# EAGLE design Battery board V2 (EAGLE 7.6.0)
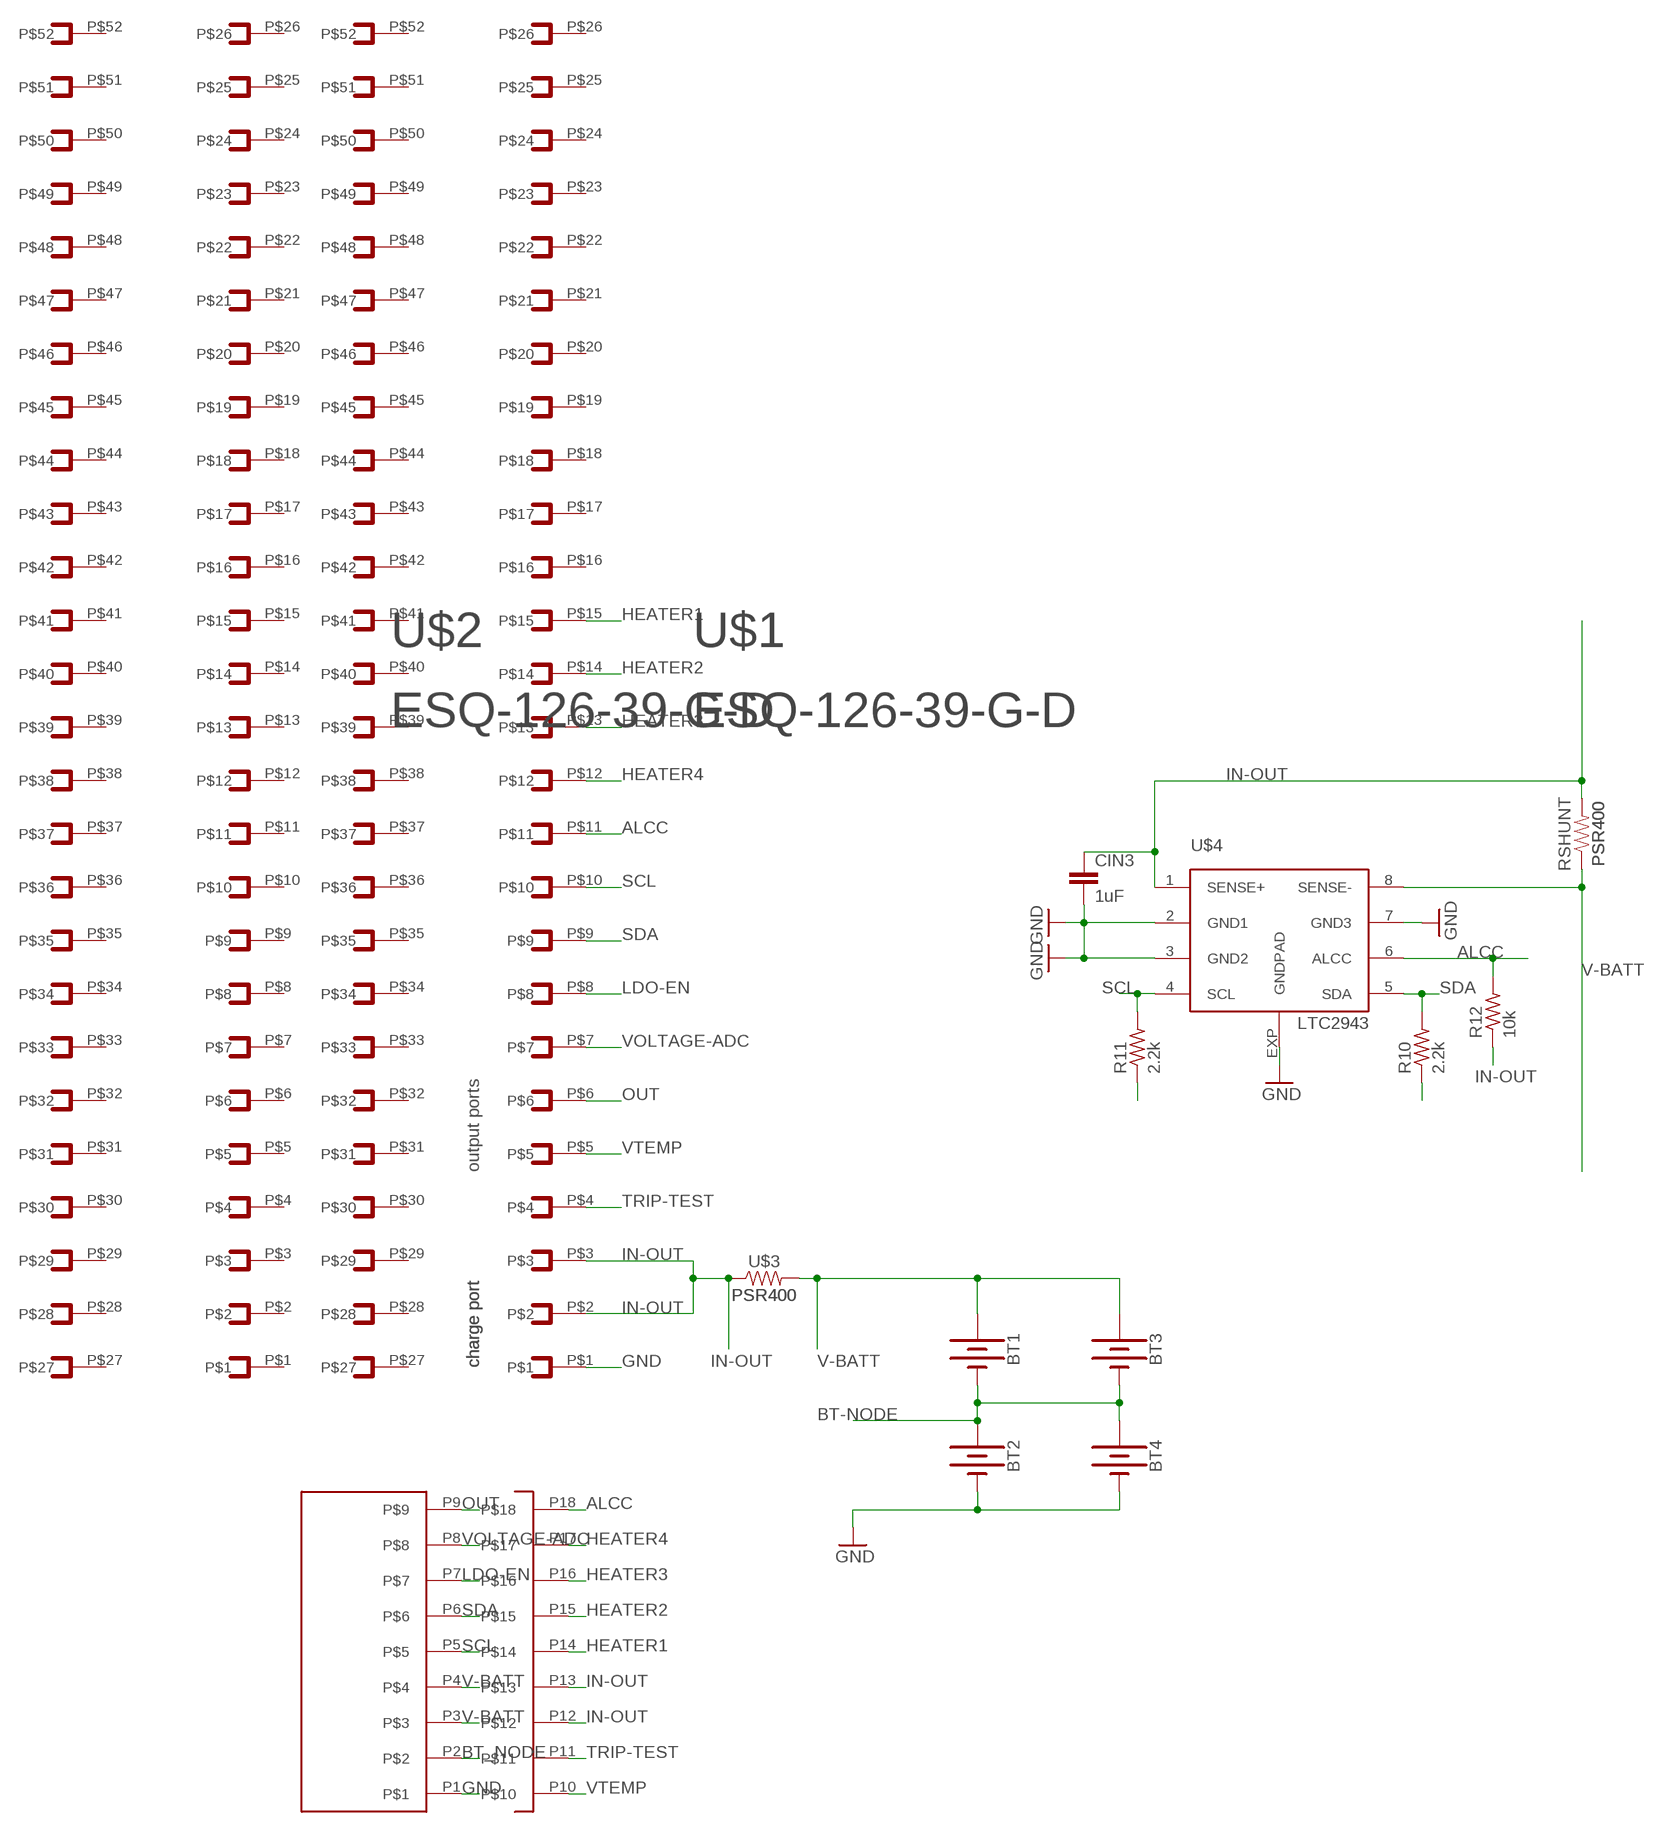
[diagram p0: schematic, sheet 1]

## Parts
BT1  BATTERY-18650  [BATTERY_18650-HOLDER]
BT2  BATTERY-18650  [BATTERY_18650-HOLDER]
BT3  BATTERY-18650  [BATTERY_18650-HOLDER]
BT4  BATTERY-18650  [BATTERY_18650-HOLDER]
CIN3  1uF  .1UF-CER  [0402-CAP]
R10  2.2k  R-US_R0805  [R0805]
R11  2.2k  R-US_R0805  [R0805]
R12  10k  R-US_R0805  [R0805]
RSHUNT  PSR400  [PSR400]
U$1  ESQ-126-39-G-D  [(RD)ESQ-126-39-G-D]
U$2  ESQ-126-39-G-D  [(RD)ESQ-126-39-G-D]
U$3  PSR400  [PSR400]
U$4  LTC2943  [DFN8(3X3)LT]
U$7  FFC18  [FFC18]

## Nets
ALCC: R12.2 U$1.P$11 U$4.6(ALCC) U$7.P18
BT-NODE: BT1.GND@1(-) BT2.PWR@1(+) BT3.GND@1(-) BT4.PWR@1(+)
BT_NODE: U$7.P2
GND: BT2.GND@1(-) BT4.GND@1(-) CIN3.2 U$1.P$1 U$4.2(GND1) U$4.3(GND2) U$4.7(GND3) U$4.EXP(GNDPAD) U$7.P1
HEATER1: U$1.P$15 U$7.P14
HEATER2: U$1.P$14 U$7.P15
HEATER3: U$1.P$13 U$7.P16
HEATER4: U$1.P$12 U$7.P17
IN-OUT: CIN3.1 R10.1 R11.1 R12.1 RSHUNT.P$2 U$1.P$2 U$1.P$3 U$3.P$1 U$4.1(SENSE+) U$7.P12 U$7.P13
LDO-EN: U$1.P$8 U$7.P7
OUT: U$1.P$6 U$7.P9
SCL: R11.2 U$1.P$10 U$4.4(SCL) U$7.P5
SDA: R10.2 U$1.P$9 U$4.5(SDA) U$7.P6
TRIP-TEST: U$1.P$4 U$7.P11
V-BATT: BT1.PWR@1(+) BT3.PWR@1(+) RSHUNT.P$1 U$3.P$2 U$4.8(SENSE-) U$7.P3 U$7.P4
VOLTAGE-ADC: U$1.P$7 U$7.P8
VTEMP: U$1.P$5 U$7.P10
Unconnected: U$1.P$16 U$1.P$17 U$1.P$18 U$1.P$19 U$1.P$20 U$1.P$21 U$1.P$22 U$1.P$23 U$1.P$24 U$1.P$25 U$1.P$26 U$1.P$27 U$1.P$28 U$1.P$29 U$1.P$30 U$1.P$31 U$1.P$32 U$1.P$33 U$1.P$34 U$1.P$35 U$1.P$36 U$1.P$37 U$1.P$38 U$1.P$39 U$1.P$40 U$1.P$41 U$1.P$42 U$1.P$43 U$1.P$44 U$1.P$45 U$1.P$46 U$1.P$47 U$1.P$48 U$1.P$49 U$1.P$50 U$1.P$51 U$1.P$52 U$2.P$1 U$2.P$2 U$2.P$3 U$2.P$4 U$2.P$5 U$2.P$6 U$2.P$7 U$2.P$8 U$2.P$9 U$2.P$10 U$2.P$11 U$2.P$12 U$2.P$13 U$2.P$14 U$2.P$15 U$2.P$16 U$2.P$17 U$2.P$18 U$2.P$19 U$2.P$20 U$2.P$21 U$2.P$22 U$2.P$23 U$2.P$24 U$2.P$25 U$2.P$26 U$2.P$27 U$2.P$28 U$2.P$29 U$2.P$30 U$2.P$31 U$2.P$32 U$2.P$33 U$2.P$34 U$2.P$35 U$2.P$36 U$2.P$37 U$2.P$38 U$2.P$39 U$2.P$40 U$2.P$41 U$2.P$42 U$2.P$43 U$2.P$44 U$2.P$45 U$2.P$46 U$2.P$47 U$2.P$48 U$2.P$49 U$2.P$50 U$2.P$51 U$2.P$52

## Notes on the sheet
- output ports
- charge port | charge port

## Library data of the parts
BT1-BT4 = SparkFun-Batteries:BATTERY: Battery - Single Cell A variety of battery chemistries, sizes, and footprints. Device List: 20MM_PTH - Coin Cell Battery Holder - 20mm (PTH) <https://www.sparkfun.com/products/783> 12MM_SMD - Coin Cell Battery Holder - 12mm (SMD) <https://www.sparkfun.com/products/10592> 12MM_PTH - Coin Cell Battery Holder - 12mm (PTH) <https://www.sparkfun.com/products/7948> 20MM_SMD - 20mm Coin Cell Battery Holder (SMD) (2 legs) Used on the Big Time Watch Kit <https://www.sparkfun.com/products/11734> 20MM_SMD_4LEGS - Coin Cell Battery Holder - 20mm (SMD) <https://www.sparkfun.com/products/11892> 20MM_SMD_4LEGS_OVERPASTE - Coin Cell Battery Holder - 20mm (SMD) <https://www.sparkfun.com/products/11892> (Over-paste on the legs) 24.5MM_PTH - Coin Cell Battery Holder - 24.5mm (PTH) <https://www.sparkfun.com/products/8863> 9V - 9V Battery Holder - PC Mount Used on the SparkFun SparkPunk Sound Kit <https://www.sparkfun.com/products/11177> and SparkFun SparkPunk Sequencer Kit <https://www.sparkfun.com/products/12707> 18650 - Battery Holder - 18650 (PTH) <https://www.sparkfun.com/products/13113> AA - Battery Holder - 1xAA (PTH) <https://www.sparkfun.com/products/7949> AAA - Battery Holder - 1xAAA (PTH) <https://www.sparkfun.com/products/12718> AA_KIT - Battery Holder - 1xAA (PTH) <https://www.sparkfun.com/products/7949> Special kit package - pads only have exposed copper on one side of the board. AAA_KIT - Battery Holder - 1xAAA (PTH) <https://www.sparkfun.com/products/12718> Special kit package - pads only have exposed copper on one side of the board.; PROD_ID: BATT-12327; SF_SKU: PRT-13113
CIN3 = SparkFun-Retired:.1UF-CER: .1uF ceramic SMT CAP-00810- 25V +80%/-20% (0603) CAP-08390- 100V 10% (0603) CAP-08604- 25V 5% (0603); PROD_ID: CAP-00810; VALUE: 0.1uF
R10-R12 = rcl:R-US_: RESISTOR, American symbol
RSHUNT U$3 = Parts for Power Team1:PSR400
U$1 U$2 = Parts for Power Team:ESQ-126-39-G-D
U$4 = Parts for Power Team:LTC2943
U$7 = Parts for Power Team1:FFC18

## Board
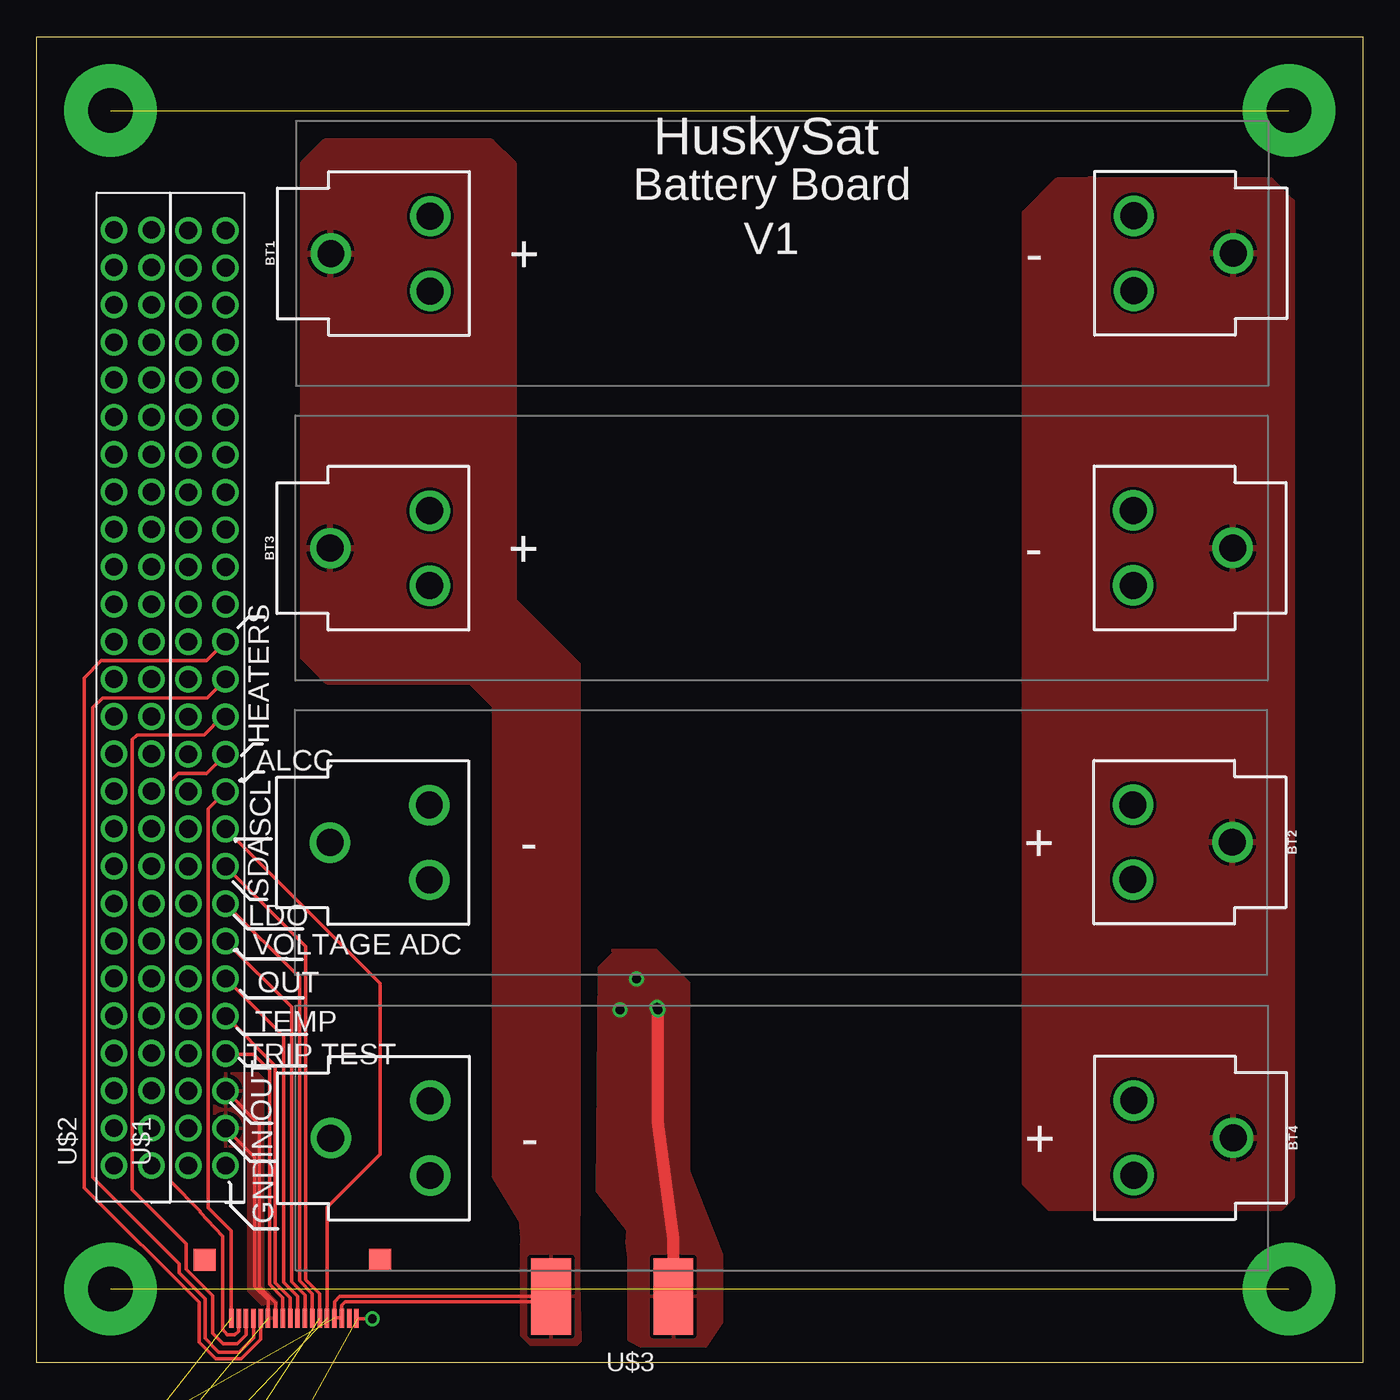
[diagram p1: board, top side]
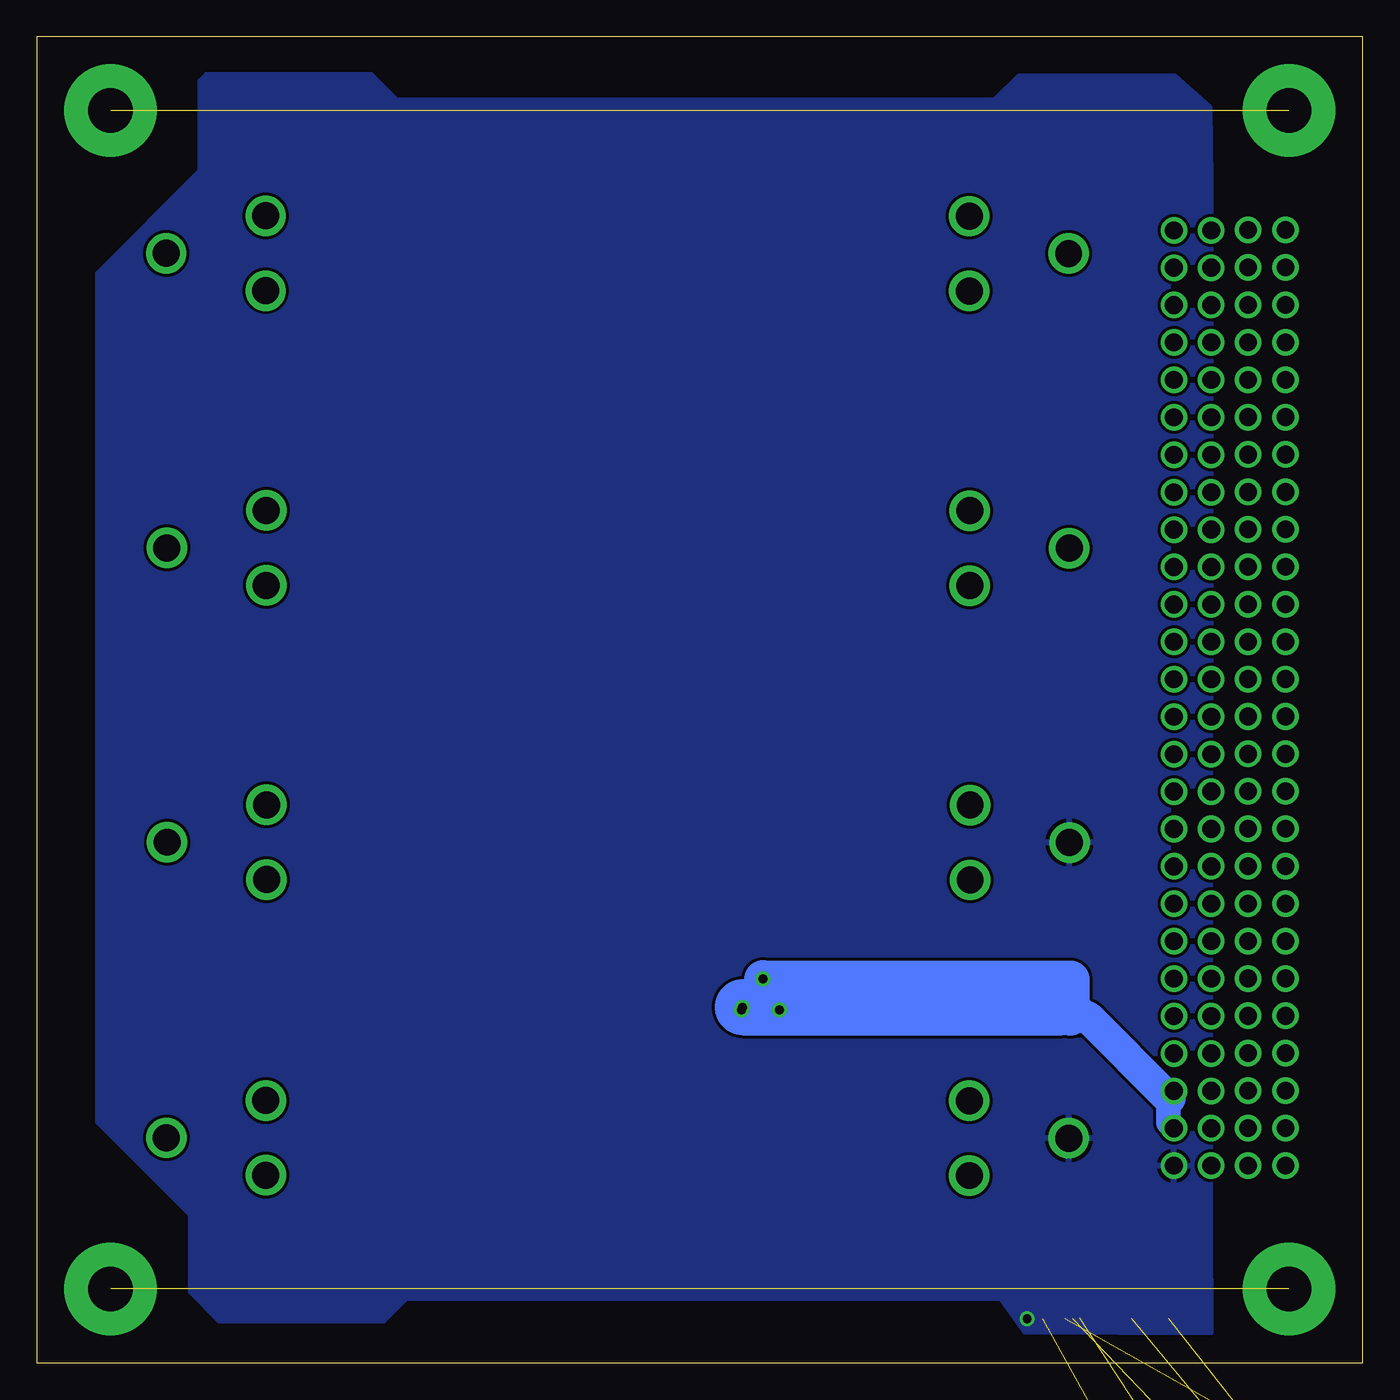
[diagram p2: board, bottom side, seen from below]

Size 90 x 90 mm. Coordinates in mm from the lower left corner, seen from the top.
Outline: 0,0 0,90 90,90 90,0 0,0
Copper layers (1*16): Top 0.035mm / dielectric 1.5mm / Bottom 0.035mm
Design rules "default": minimum track width 10mil, minimum drill 24mil, track to track 8mil, track to pad 8mil, pad to pad 8mil, via to via 8mil, smd to smd 8mil, copper to edge 40mil, drill to drill 8mil, minimum pad ring 10mil, minimum via ring 8mil, stop-mask expansion 4mil, vias tented up to drill 0mil, thermal gap 10mil
tKeepout: area 0,80.3 to 10,90; area 25,86 to 65,90; area 0,0 to 10,9.7; area 86,25 to 90,65; area 80,0 to 90,10; area 80,80 to 90,90; area 25.1,0 to 65.1,4; area 10.1,0 to 25.1,2; area 65,0 to 80,2; area 88,10 to 90,25; area 88,65 to 90,80; area 65,88 to 80,90; area 10,88 to 25,90; area 0,9.7 to 2,80.3; area 2,9.7 to 15.8,80.3

### Footprints (pad centres in the part's own frame; a part is rotated, then mirrored left to right if it is on the bottom)
BATTERY_18650-HOLDER = drill 1.829: GND@1 30.628,0.01; GND@2 23.88,2.55; GND@3 23.88,-2.53; PWR@1 -30.628,-0.01; PWR@2 -23.88,2.53; PWR@3 -23.88,-2.55
0402-CAP = smd 0.7 x 0.9: 1 -0.65,0; 2 0.65,0
R0805 = smd 1.3 x 1.5: 1 -0.95,0; 2 0.95,0
PSR400 = smd 2.7 x 5.2: P$1 0,0; P$2 8.3,0
(RD)ESQ-126-39-G-D = drill 1.2: P$1 0,0; P$2 2.54,0; P$3 5.08,0; P$4 7.62,0; P$5 10.16,0; P$6 12.7,0; P$7 15.24,0; P$8 17.78,0; P$9 20.32,0; P$10 22.86,0; P$11 25.4,0; P$12 27.94,0; P$13 30.48,0; P$14 33.02,0; P$15 35.56,0; P$16 38.1,0; P$17 40.64,0; P$18 43.18,0; P$19 45.72,0; P$20 48.26,0; P$21 50.8,0; P$22 53.34,0; P$23 55.88,0; P$24 58.42,0; P$25 60.96,0; P$26 63.5,0; P$27 0,2.54; P$28 2.54,2.54; P$29 5.08,2.54; P$30 7.62,2.54; P$31 10.16,2.54; P$32 12.7,2.54; P$33 15.24,2.54; P$34 17.78,2.54; P$35 20.32,2.54; P$36 22.86,2.54; P$37 25.4,2.54; P$38 27.94,2.54; P$39 30.48,2.54; P$40 33.02,2.54; P$41 35.56,2.54; P$42 38.1,2.54; P$43 40.64,2.54; P$44 43.18,2.54; P$45 45.72,2.54; P$46 48.26,2.54; P$47 50.8,2.54; P$48 53.34,2.54; P$49 55.88,2.54; P$50 58.42,2.54; P$51 60.96,2.54; P$52 63.5,2.54
DFN8(3X3)LT = smd 0.25 x 0.45: 1 -2.02,-0.08; 2 -1.52,-0.08; 3 -1.02,-0.08; 4 -0.52,-0.08; 5 -0.52,2.62; 6 -1.02,2.62; 7 -1.52,2.62; 8 -2.02,2.62 | smd 2.38 x 1.65: EXP -1.27,1.27
FFC18 = smd 1.5 x 1.5: MOUNT1 0.75,0.75; MOUNT2 12.65,0.75 | smd 0.305 x 1.27: P1 2.35,4.735; P2 2.85,4.735; P3 3.35,4.735; P4 3.85,4.735; P5 4.35,4.735; P6 4.85,4.735; P7 5.35,4.735; P8 5.85,4.735; P9 6.35,4.735; P10 6.85,4.735; P11 7.35,4.735; P12 7.85,4.735; P13 8.35,4.735; P14 8.85,4.735; P15 9.35,4.735; P16 9.85,4.735; P17 10.35,4.735; P18 10.85,4.735; P$9 10.35,4.735

### Placement (x,y rotation side)
BT1  50.59,75.3 0 top
BT2  50.53,35.32 180 top
BT3  50.55,55.3 0 top
BT4  50.58,15.25 180 top
CIN3  6.46,-23.36 0 top  (outside the outline)
R10  4.7,-17.8 0 top  (outside the outline)
R11  -3.27,-25.08 0 top  (outside the outline)
R12  1.97,-25.08 0 top  (outside the outline)
RSHUNT  -3.81,-10.52 0 top  (outside the outline)
U$1  12.82,13.37 90 top
U$2  7.78,13.38 90 top
U$3  43.2,4.49 180 top
U$4  -1.58,-19.7 0 top  (outside the outline)
U$7  24.05,7.74 180 top

### Tracks (layer width: path | path; a pad name or v marks a point on that pad's centre or on a via)
ALCC  (2 unrouted)
  Top 0.254: U$7.P18 13.2,8.94 11.63,10.51 11.63,37.59 U$1.P$11
BT-NODE
  pour Top: 72.02,80.25 83.76,80.25 85.2,78.81 85.2,11.27 84.42,10.48 68.77,10.48 67.07,12.18 67.07,78.03 69.28,80.25 71.37,80.25 71.5,80.38
GND  (via drill 0.6)  (5 unrouted)
  Top 0.254: U$7.P1 21.73,2.98 v22.78,2.98
  pour Bottom: 10.34,2.03 22.88,2.09 24.51,4.36 64.96,4.36 66.48,2.84 77.57,2.84 79.53,4.8 79.53,10.03 85.84,16.34 85.84,73.94 78.88,80.9 78.88,87 78.44,87.43 67.36,87.43 65.61,85.69 24.95,85.69 23.32,87.32 12.77,87.32 10.41,85.21 10.34,80.17 10.38,9.38
HEATER1
  Top 0.254: U$7.P14 15.2,1.58 13.89,0.26 12.14,0.26 11.01,1.39 11.01,4.08 3.22,11.87 3.22,46.49 4.39,47.65 11.54,47.65 U$1.P$15
HEATER2
  Top 0.254: U$7.P15 14.7,1.7 13.73,0.72 12.36,0.72 11.43,1.65 11.43,4.32 9.66,6.09 9.66,6.7 3.79,12.58 3.79,44.46 4.46,45.13 11.56,45.13 U$1.P$14
HEATER3
  Top 0.254: U$7.P16 14.2,1.89 13.6,1.29 12.65,1.29 11.94,2.01 11.94,4.53 10.15,6.32 10.15,8.07 6.48,11.73 6.48,42.29 6.8,42.61 11.35,42.61 12.59,43.85 U$1.P$13
HEATER4
  Top 0.254: U$7.P17 13.7,2.14 13.45,1.89 12.9,1.89 12.62,2.27 12.62,8.57 11.1,10.19 11.1,10.29 9.08,12.31 9.08,39.5 9.59,40.01 11.52,40.01 U$1.P$12
IN-OUT  (via drill 0.6)  (6 unrouted)
  Top 0.254: U$7.P13 15.7,4.25 14.8,5.15 14.8,13.92 U$1.P$2 | U$7.P12 16.2,4.06 15.11,5.16 15.11,16.17 12.77,18.51 12.77,18.49 12.83,18.43
  Top 0.813: U$3.P$1 43.2,8.42 42.15,16.32 42.15,24.06 v42.09,24.13
  Bottom 1.676: 20.38,24.13 19.21,24.13 13.18,18.1 13.18,16.28 U$1.P$2
  Bottom 2.184: 19.84,23.47 18.66,23.47 13.11,17.92
  Bottom 2.54: v40.71,26.06 19.81,26.02 19.81,23.5 19.84,23.47
  Bottom 3.81: v42.09,24.13 20.38,24.13
  other vias: 39.6,23.95 42.16,23.95
  pour Top: 15.65,2.61 15.65,3.6 14.39,4.86 14.39,13.74 13.4,14.73 12.34,14.73 12.04,15.03 12.04,18.89 12.76,19.61 14.99,19.61 15.32,19.28 15.32,5.07 16.31,4.08 16.31,2.52 16.34,2.49
  pour Top: 39.09,27.98 42.02,27.98 44.23,25.77 44.23,12.98 46.49,7.33 46.49,2.73 45.4,1.11 41.04,1.11 40.2,1.55 40.2,7.1 40.08,8.13 40.15,9 38.05,11.64 38.2,26.85 39.27,27.92
LDO-EN
  Top 0.254: U$7.P7 18.7,4.68 17.82,5.56 17.82,26.14 U$1.P$8
N$2
  pour Bottom (isolate 0.254): 41,27.89 21.05,27.89 18.69,25.52 18.69,21.19 18.87,21.01 43.11,21.01 44.6,22.5 44.6,25.67 44.5,25.78 43.48,25.78 41.26,28
OUT
  Top 0.254: U$7.P9 17.7,4.51 16.74,5.47 16.74,22.14 U$1.P$6
S$1  (via drill 3.02 pad 6.3)  (1 unrouted)
  other vias: 5,5 85,5
S$2  (via drill 3.02 pad 6.3)  (1 unrouted)
  other vias: 5,85 85,85
SCL  (2 unrouted)
  Top 0.254: U$7.P5 19.7,10.54 23.29,14.13 23.29,25.75 U$1.P$10
SDA  (2 unrouted)
  Top 0.254: U$7.P6 19.2,4.68 18.26,5.63 18.26,28.25 U$1.P$9
TRIP-TEST
  Top 0.254: U$7.P11 16.7,4.41 15.79,5.33 15.79,19.85 14.71,20.93 12.87,20.93 U$1.P$4
V-BATT  (2 unrouted)
  Top 0.254: U$7.P3 20.7,3.91 20.92,4.13 34.55,4.13 | 34.08,3.67 34.55,4.13 | 34.55,4.13 U$3.P$2 20.56,4.49 20.2,4.14 U$7.P4 20.2,3.03 20.23,3.06 20.68,3.06 20.74,3 | 34.33,4.35 34.55,4.13
  pour Top: 18.03,81.27 18.03,47.92 19.7,46.25 30.57,46.25 32.39,48.08 32.39,81.37 30.88,82.88 19.54,82.88 18.08,81.42
  pour Top: 28.71,48.17 28.71,46.86 31.02,44.55 31.02,12.64 32.85,9.63 32.92,8.4 32.9,7.84 32.91,1.87 33.52,1.26 36.63,1.23 36.89,1.49 36.79,5.44 36.81,14.42 36.81,47.42 31.72,52.51 31.72,51.64 31.32,51.25
VOLTAGE-ADC
  Top 0.254: U$7.P8 18.2,4.59 17.28,5.5 17.28,24.14 U$1.P$7
VTEMP
  Top 0.254: U$7.P10 17.2,4.4 16.19,5.42 16.19,20.16 U$1.P$5

### Text on the board
tSilk: HuskySat | Battery Board | V1 | HEATERS | ALCC | SCL | SDA | LDO | VOLTAGE ADC | OUT | TEMP | TRIP TEST | OUT | IN | GND